# EAGLE design door (EAGLE 7.6.0)
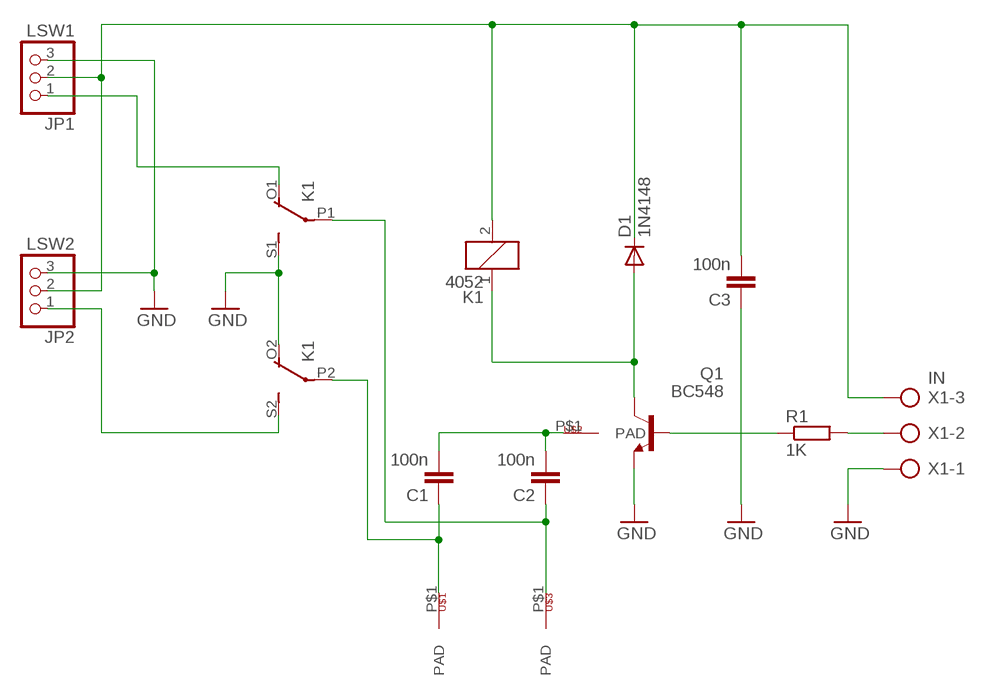
[diagram p0: schematic, sheet 1]

## Parts
C1  100n  C-EU050-025X075  [C050-025X075]
C2  100n  C-EU050-025X075  [C050-025X075]
C3  100n  C-EU050-025X075  [C050-025X075]
D1  1N4148  1N4148DO35-7  [DO35-7]
JP1  LSW1  PINHD-1X3  [1X03]
JP2  LSW2  PINHD-1X3  [1X03]
K1  4052  [F4052]
Q1  BC548  [TO92-EBC]
R1  1K  R-EU_0204/7  [0204/7]
U$1  PAD  [PAD]
U$2  PAD  [PAD]
U$3  PAD  [PAD]
X1  IN  AK300/3  [AK300/3]

## Nets
+24VDC: C3.2 D1.C JP1.2 JP2.2 K1.2 X1.3
DRIVE: R1.2 X1.2
GND: C3.1 JP1.3 JP2.3 K1.O2(3:O) K1.S1(2:S) Q1.E X1.1
N$2: D1.A K1.1 Q1.C
N$3: Q1.B R1.1
N$5: JP2.1 K1.S2(3:S)
N$6: C2.1 K1.P1(2:P) U$3.P$1(PAD)
N$7: C1.1 K1.P2(3:P) U$1.P$1(PAD)
N$8: C1.2 C2.2 U$2.P$1(PAD)
N$9: JP1.1 K1.O1(2:O)

## Library data of the parts
C1-C3 = rcl:C-EU: CAPACITOR, European symbol
D1 = diode:1N4148: DIODE high speed (Philips)
JP1 JP2 = pinhead:PINHD-1X3: PIN HEADER
K1 = relay:4052: RELAY 2 x switch, Finder; OC_FARNELL: unknown; OC_NEWARK: unknown
Q1 = transistor-npn:BC548*: NPN Transistor
R1 = rcl:R-EU_: RESISTOR, European symbol
U$1-U$3 = LEG-1A-5:PAD
X1 = con-ptr500:AK300/3: CONNECTOR; OC_FARNELL: unknown; OC_NEWARK: unknown

## Board
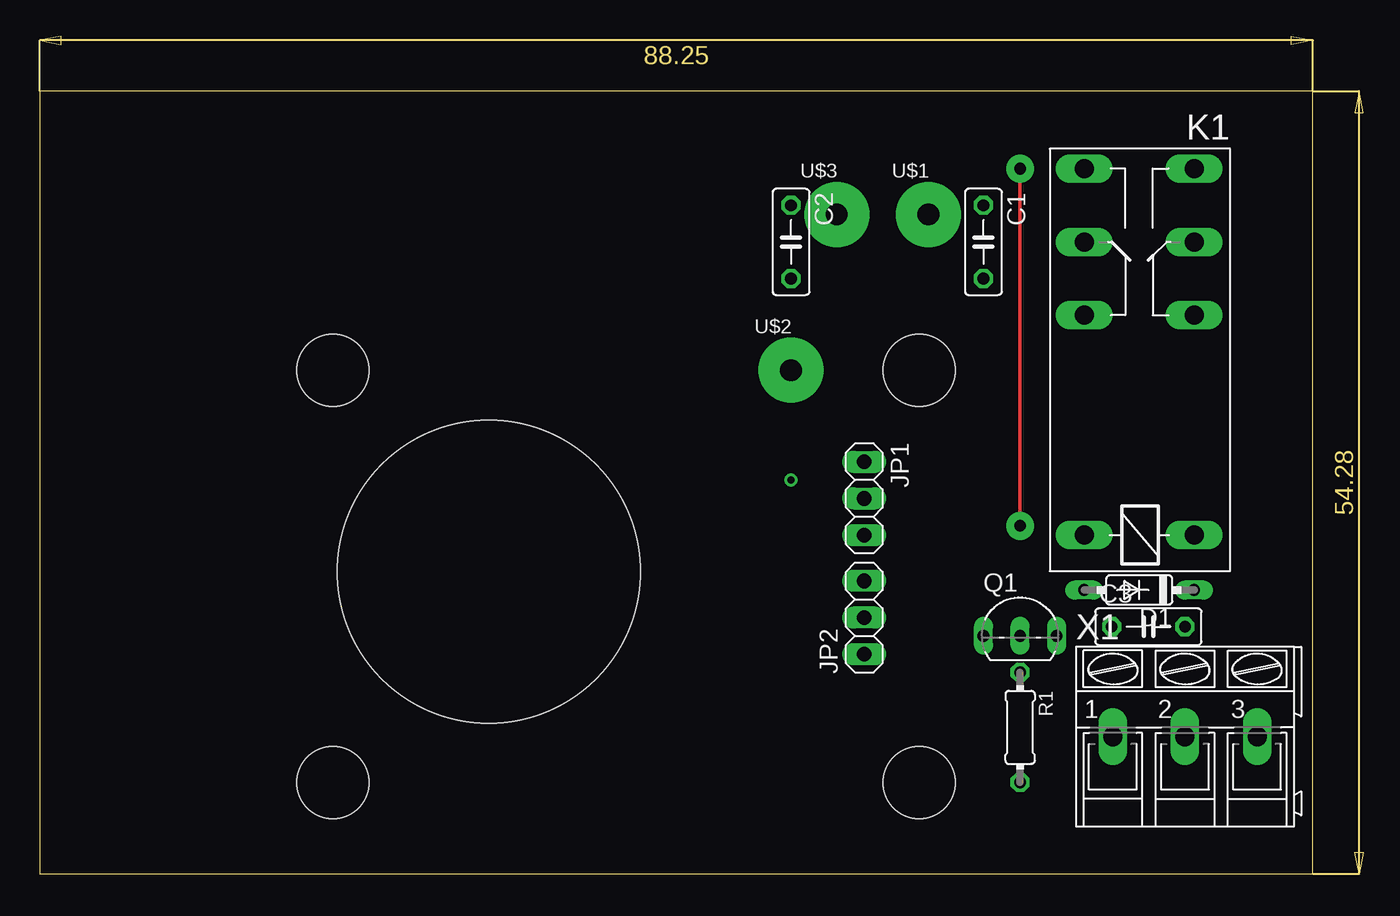
[diagram p1: board, top side]
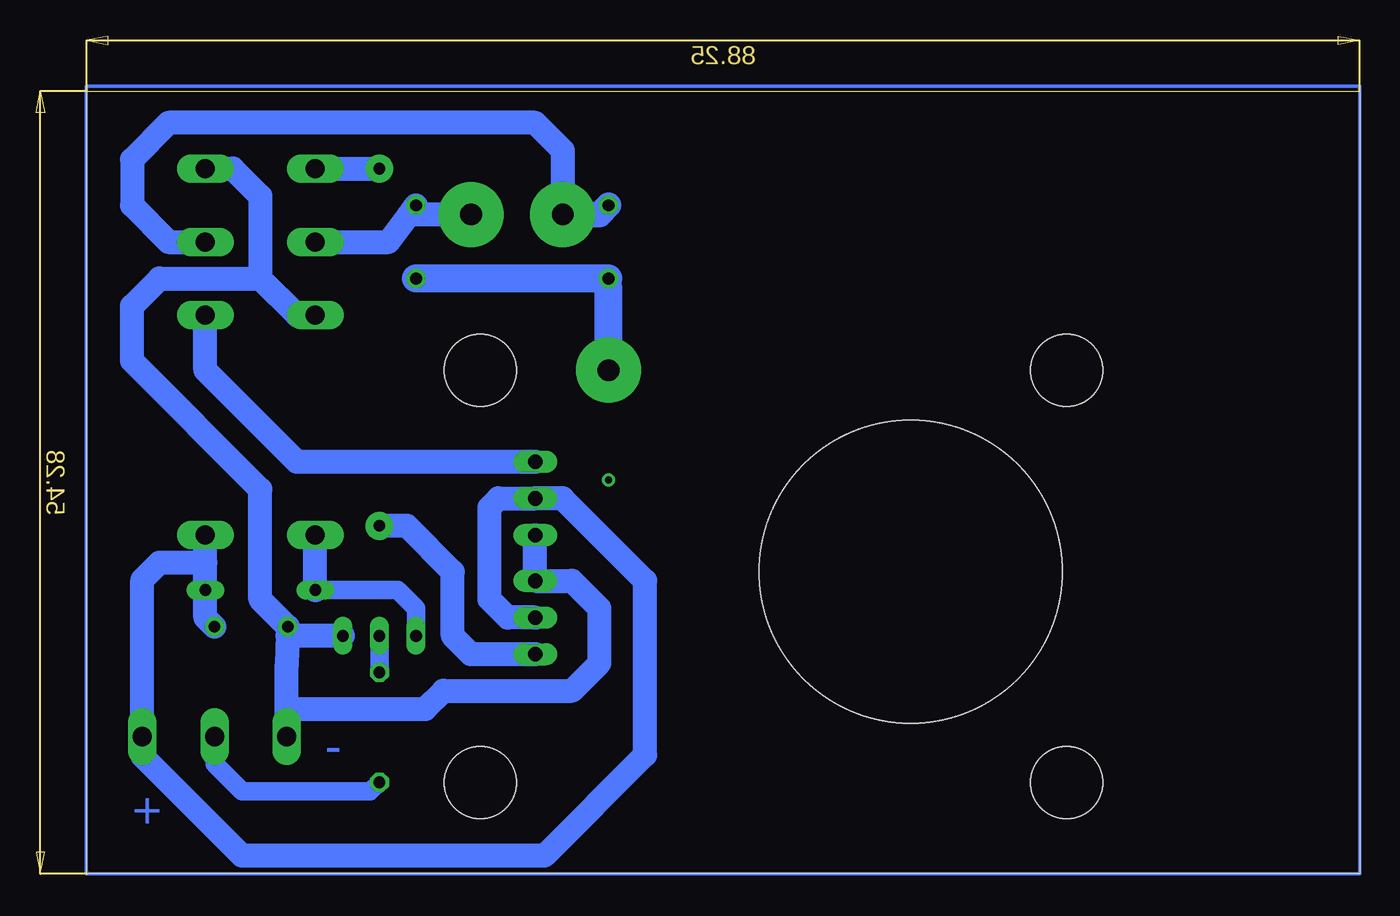
[diagram p2: board, bottom side, seen from below]

Size 88.25 x 54.28 mm. Coordinates in mm from the lower left corner, seen from the top.
Outline: 0,0 88.25,0 88.25,54.28 0,54.28 0,0
Copper layers (1*16): Top 0.035mm / dielectric 1.5mm / Bottom 0.035mm
Design rules "default": minimum track width 10mil, minimum drill 24mil, track to track 8mil, track to pad 8mil, pad to pad 8mil, via to via 8mil, smd to smd 8mil, copper to edge 40mil, drill to drill 8mil, minimum pad ring 10mil, minimum via ring 8mil, stop-mask expansion 4mil, vias tented up to drill 0mil, thermal gap 10mil
Holes 5 mm at 20.32,6.35 60.96,6.35 20.32,34.92 60.96,34.92
Holes 21 mm at 31.11,20.95

### Footprints (pad centres in the part's own frame; a part is rotated, then mirrored left to right if it is on the bottom)
C050-025X075 = drill 0.813 octagon: 1 -2.54,0; 2 2.54,0
DO35-7 = drill 0.813 long: A 3.81,0; C -3.81,0
1X03 = drill 1.016 long: 1 -2.54,0; 2 0,0; 3 2.54,0
F4052 = drill 1.321 long: 1 -3.81,3.81; 2 -3.81,-3.81; O1 11.43,-3.81; O2 11.43,3.81; P1 16.51,-3.81; P2 16.51,3.81; S1 21.59,-3.81; S2 21.59,3.81
TO92-EBC = drill 0.813 long: B 0,-1.27; C -2.54,-1.27; E 2.54,-1.27
0204/7 = drill 0.813 octagon: 1 -3.81,0; 2 3.81,0
PAD = drill 1.5 pad 4.5: P$1 0,0
AK300/3 = drill 1.321 long: 1 -5.004,0; 2 0,0; 3 5.004,0

### Placement (x,y rotation side)
C1  65.41,43.81 270 top
C2  52.07,43.81 270 top
C3  76.83,17.14 0 top
D1  76.2,19.68 180 top
JP1  57.15,26.04 270 top
JP2  57.15,17.78 90 top
K1  76.2,27.3 90 top
Q1  67.94,17.78 0 top
R1  67.94,10.16 270 top
U$1  61.59,45.72 0 top
U$2  52.07,34.92 0 top
U$3  55.24,45.72 0 top
X1  79.38,9.53 0 top

### Tracks (layer width: path | path; a pad name or v marks a point on that pad's centre or on a via)
+24VDC
  Bottom 1.676: 80.01,21.59 D1.C 80.01,17.78 C3.2 | 80.01,21.59 K1.2 | 80.01,21.59 83.19,21.59 84.38,20.4 X1.3 84.38,8.18 77.47,1.27 56.52,1.27 49.53,8.26 49.53,20.32 55.24,26.04 JP1.2 59.69,26.04 60.33,25.4 60.33,19.05 59.05,17.78 JP2.2
DRIVE
  Bottom 1.27: R1.2 68.58,5.71 77.47,5.71 79.38,7.62 X1.2
GND
  Bottom 1.27: 74.29,16.51 74.31,16.53
  Bottom 1.676: Q1.E 74.29,16.51 | 76.2,41.27 83.19,41.27 85.09,39.37 85.09,35.56 76.2,26.67 76.2,19.05 C3.1 74.31,16.53 74.37,14.53 X1.1 74.37,11.43 64.77,11.43 63.5,12.7 54.61,12.7 52.7,14.61 52.7,18.41 54.61,20.32 JP2.3 JP1.3 | K1.O2 73.66,38.73 76.2,41.27 | K1.S1 78.11,48.9 76.2,46.99 76.2,41.27
N$1
  Bottom 0.254: 0,54.61 88.27,54.61 88.27,0 0,0 0,54.61
N$2
  Bottom 1.27: Q1.C 65.41,18.41 66.67,19.68 D1.A
  Bottom 1.676: D1.A K1.1
N$3
  Bottom 1.27: R1.1 Q1.B
N$4  (via drill 0.5)
  other vias: 52.07,27.3
N$5  (via drill 0.8 pad 1.93)
  Top 0.254: v67.94,48.9 v67.94,24.13
  Bottom 1.676: K1.S2 v67.94,48.9 | JP2.1 61.59,15.24 62.87,16.51 62.87,20.95 66.04,24.13 v67.94,24.13
N$6
  Bottom 1.676: K1.P1 82.55,43.81 85.09,46.35 85.09,49.53 82.55,52.07 57.15,52.07 55.24,50.16 U$3.P$1
  Bottom 1.778: U$3.P$1 52.7,45.72 C2.1
N$7
  Bottom 1.676: K1.P2 67.31,43.81 65.94,45.64 | 65.94,45.64 C1.1 | U$1.P$1 65.86,45.72 65.94,45.64
N$8
  Bottom 1.676: 52.07,40.64 52.7,41.27
  Bottom 1.93: C2.2 52.7,41.27 C1.2 | U$2.P$1 52.07,40.64
N$9
  Bottom 1.676: K1.O1 80.01,34.92 73.66,28.57 JP1.1

### Text on the board
Bottom: - | +